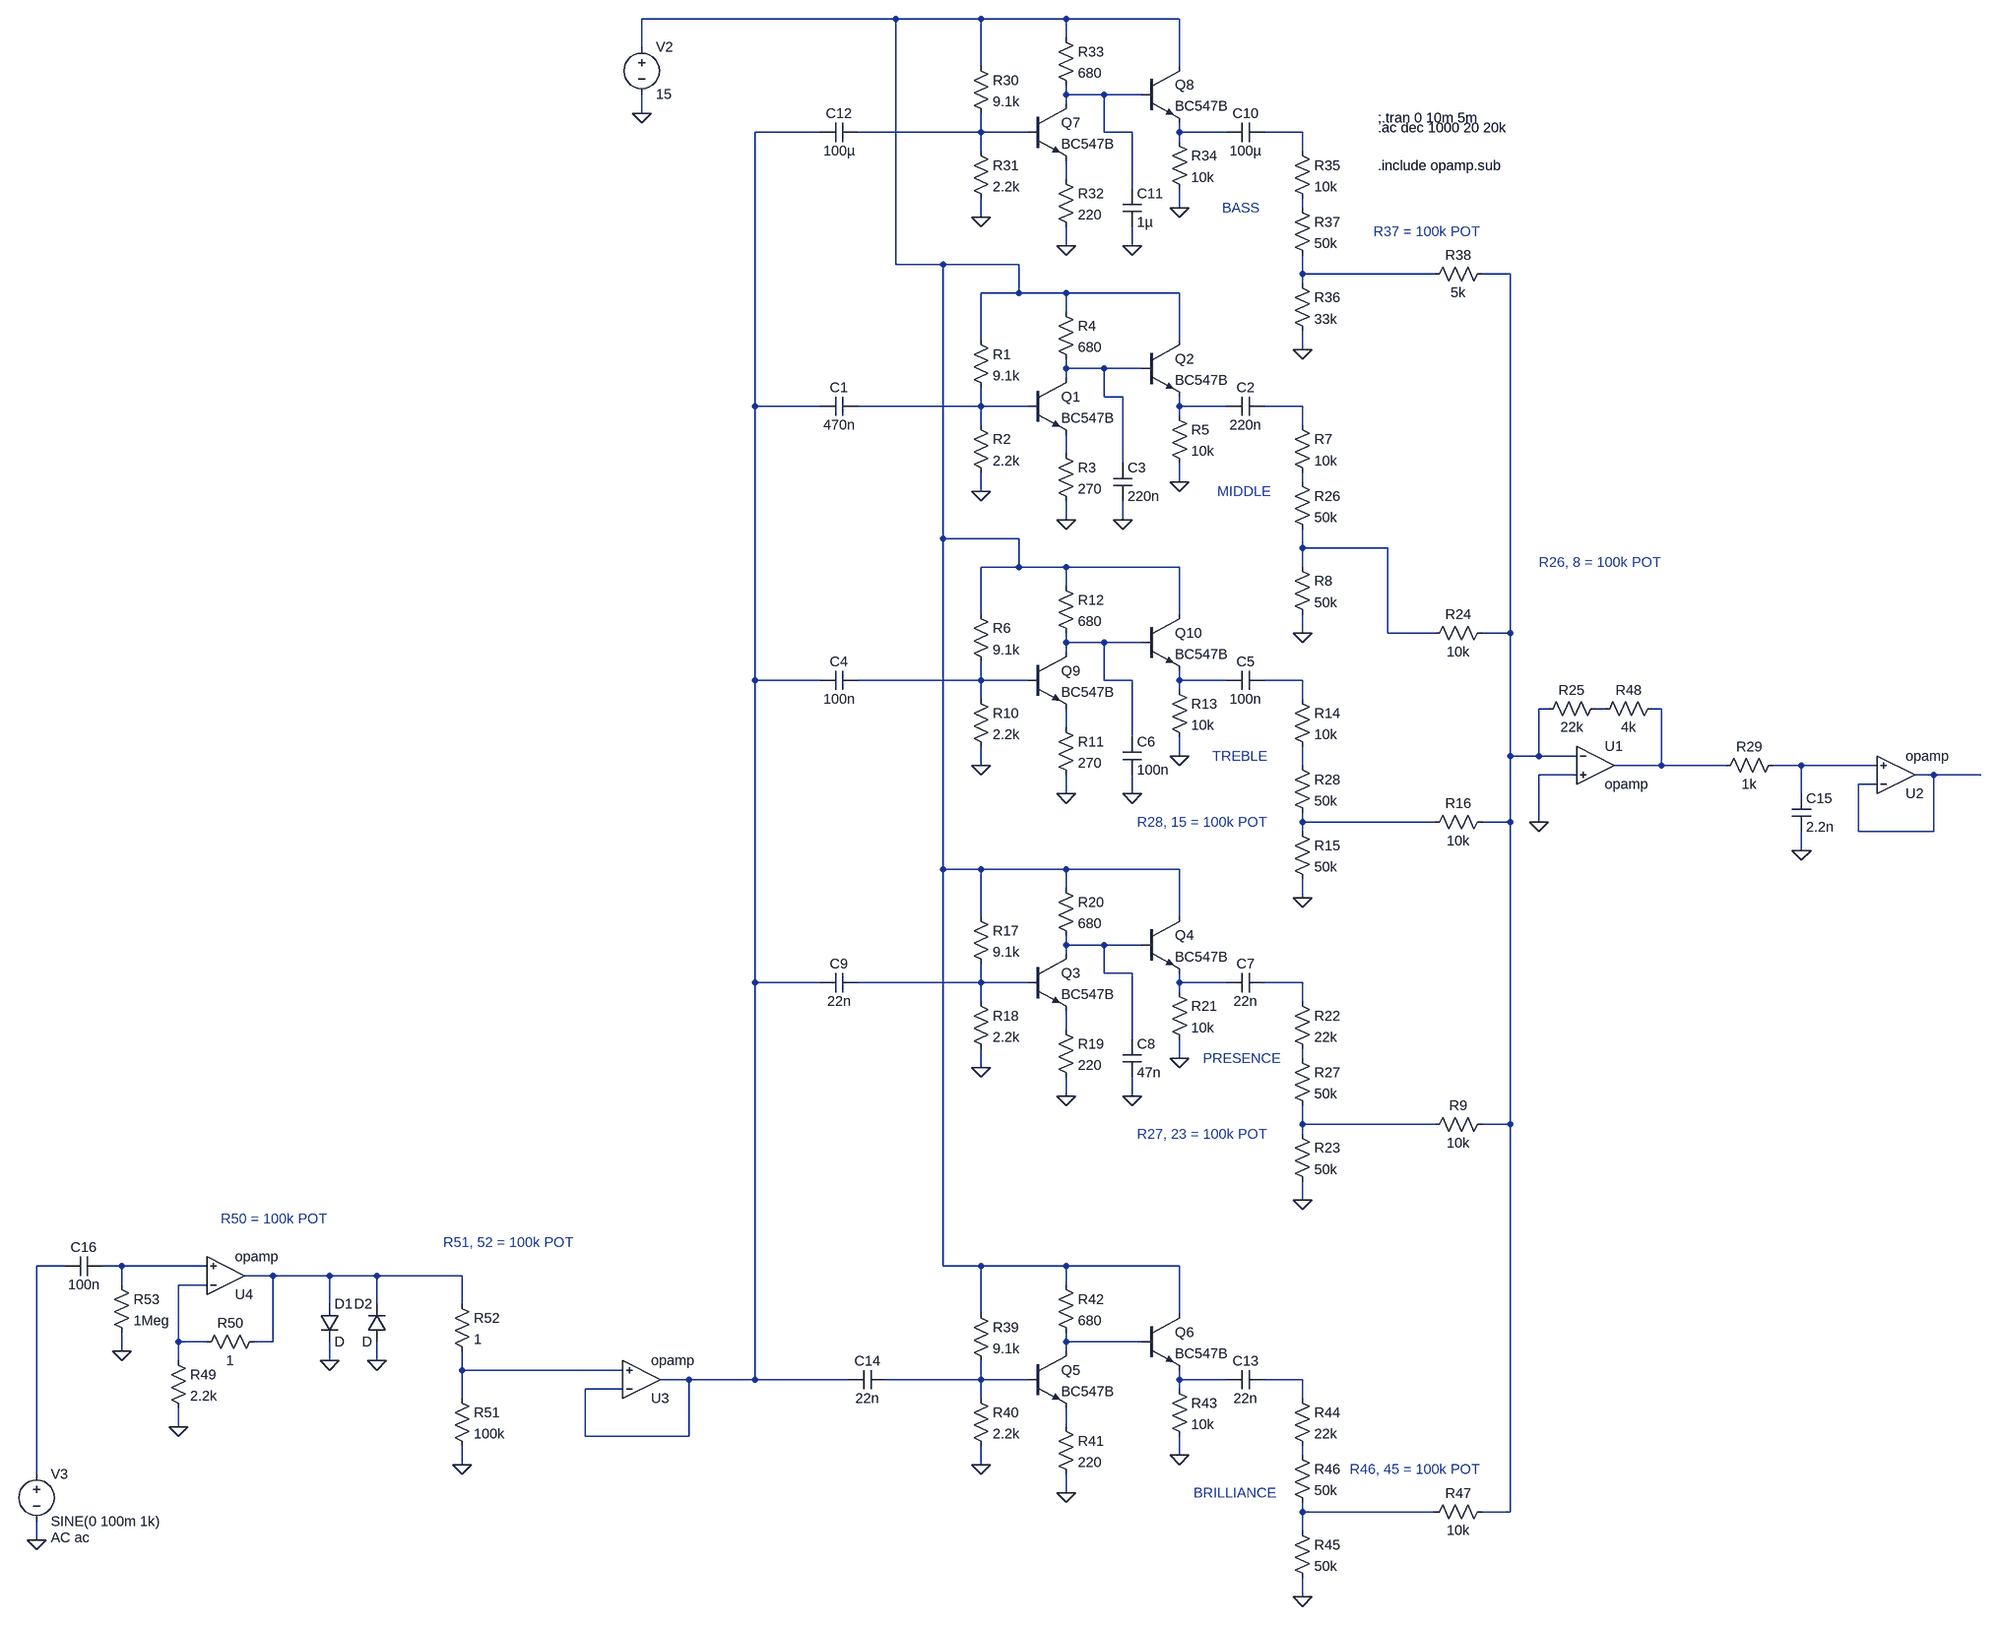
[diagram p0: schematic active-five-band-eq.asc]
active-five-band-eq.asc, the LTspice schematic file:
Version 4
SHEET 1 2264 2196
WIRE -48 -576 -480 -576
WIRE 96 -576 -48 -576
WIRE 240 -576 96 -576
WIRE 432 -576 240 -576
WIRE 240 -544 240 -576
WIRE -480 -528 -480 -576
WIRE 96 -496 96 -576
WIRE 432 -496 432 -576
WIRE 240 -448 240 -464
WIRE 304 -448 240 -448
WIRE 368 -448 304 -448
WIRE 240 -432 240 -448
WIRE -480 -416 -480 -448
WIRE -176 -384 -288 -384
WIRE 96 -384 96 -416
WIRE 96 -384 -112 -384
WIRE 176 -384 96 -384
WIRE 304 -384 304 -448
WIRE 352 -384 304 -384
WIRE 432 -384 432 -400
WIRE 512 -384 432 -384
WIRE 640 -384 576 -384
WIRE 432 -368 432 -384
WIRE 96 -352 96 -384
WIRE 640 -352 640 -384
WIRE 240 -304 240 -336
WIRE 352 -288 352 -384
WIRE 432 -256 432 -288
WIRE 640 -256 640 -272
WIRE 96 -240 96 -272
WIRE 240 -192 240 -224
WIRE 352 -192 352 -224
WIRE -48 -160 -48 -576
WIRE 32 -160 -48 -160
WIRE 160 -160 32 -160
WIRE 640 -144 640 -176
WIRE 864 -144 640 -144
WIRE 992 -144 944 -144
WIRE 640 -128 640 -144
WIRE 160 -112 160 -160
WIRE 160 -112 96 -112
WIRE 240 -112 160 -112
WIRE 432 -112 240 -112
WIRE 240 -80 240 -112
WIRE 96 -32 96 -112
WIRE 432 -32 432 -112
WIRE 640 -16 640 -48
WIRE 240 16 240 0
WIRE 304 16 240 16
WIRE 368 16 304 16
WIRE 240 32 240 16
WIRE 304 64 304 16
WIRE 336 64 304 64
WIRE -288 80 -288 -384
WIRE -176 80 -288 80
WIRE 96 80 96 48
WIRE 96 80 -112 80
WIRE 176 80 96 80
WIRE 432 80 432 64
WIRE 512 80 432 80
WIRE 640 80 576 80
WIRE 432 96 432 80
WIRE 96 112 96 80
WIRE 640 112 640 80
WIRE 240 160 240 128
WIRE 336 176 336 64
WIRE 432 208 432 176
WIRE 640 208 640 192
WIRE 96 224 96 192
WIRE 240 272 240 240
WIRE 336 272 336 240
WIRE 32 304 32 -160
WIRE 160 304 32 304
WIRE 640 320 640 288
WIRE 784 320 640 320
WIRE 160 352 160 304
WIRE 160 352 96 352
WIRE 240 352 160 352
WIRE 432 352 240 352
WIRE 640 352 640 320
WIRE 240 384 240 352
WIRE 96 432 96 352
WIRE 432 432 432 352
WIRE 640 464 640 432
WIRE 784 464 784 320
WIRE 864 464 784 464
WIRE 992 464 992 -144
WIRE 992 464 944 464
WIRE 240 480 240 464
WIRE 304 480 240 480
WIRE 368 480 304 480
WIRE 240 496 240 480
WIRE -288 544 -288 80
WIRE -176 544 -288 544
WIRE 96 544 96 512
WIRE 96 544 -112 544
WIRE 176 544 96 544
WIRE 304 544 304 480
WIRE 352 544 304 544
WIRE 432 544 432 528
WIRE 512 544 432 544
WIRE 640 544 576 544
WIRE 432 560 432 544
WIRE 96 576 96 544
WIRE 640 576 640 544
WIRE 1056 592 1040 592
WIRE 1152 592 1136 592
WIRE 1248 592 1232 592
WIRE 240 624 240 592
WIRE 352 640 352 544
WIRE 432 672 432 640
WIRE 992 672 992 464
WIRE 1040 672 1040 592
WIRE 1040 672 992 672
WIRE 1104 672 1040 672
WIRE 96 688 96 656
WIRE 640 688 640 656
WIRE 1248 688 1248 592
WIRE 1248 688 1168 688
WIRE 1360 688 1248 688
WIRE 1488 688 1440 688
WIRE 1616 688 1488 688
WIRE 1104 704 1040 704
WIRE 1712 704 1680 704
WIRE 1792 704 1712 704
WIRE 1616 720 1584 720
WIRE 240 736 240 704
WIRE 352 736 352 704
WIRE 1488 736 1488 688
WIRE 640 784 640 768
WIRE 864 784 640 784
WIRE 992 784 992 672
WIRE 992 784 944 784
WIRE 1040 784 1040 704
WIRE 640 800 640 784
WIRE 1584 800 1584 720
WIRE 1712 800 1712 704
WIRE 1712 800 1584 800
WIRE 1488 832 1488 800
WIRE 32 864 32 304
WIRE 96 864 32 864
WIRE 240 864 96 864
WIRE 432 864 240 864
WIRE 240 896 240 864
WIRE 640 912 640 880
WIRE 96 944 96 864
WIRE 432 944 432 864
WIRE 240 992 240 976
WIRE 304 992 240 992
WIRE 368 992 304 992
WIRE 240 1008 240 992
WIRE 304 1040 304 992
WIRE 352 1040 304 1040
WIRE -288 1056 -288 544
WIRE -176 1056 -288 1056
WIRE 96 1056 96 1024
WIRE 96 1056 -112 1056
WIRE 176 1056 96 1056
WIRE 432 1056 432 1040
WIRE 512 1056 432 1056
WIRE 640 1056 576 1056
WIRE 432 1072 432 1056
WIRE 96 1088 96 1056
WIRE 640 1088 640 1056
WIRE 240 1136 240 1104
WIRE 352 1152 352 1040
WIRE 432 1184 432 1152
WIRE 640 1184 640 1168
WIRE 96 1200 96 1168
WIRE 240 1248 240 1216
WIRE 352 1248 352 1216
WIRE 640 1296 640 1264
WIRE 864 1296 640 1296
WIRE 992 1296 992 784
WIRE 992 1296 944 1296
WIRE 640 1312 640 1296
WIRE 640 1424 640 1392
WIRE -1456 1536 -1504 1536
WIRE -1360 1536 -1392 1536
WIRE -1216 1536 -1360 1536
WIRE 32 1536 32 864
WIRE 96 1536 32 1536
WIRE 240 1536 96 1536
WIRE 432 1536 240 1536
WIRE -1104 1552 -1152 1552
WIRE -1008 1552 -1104 1552
WIRE -928 1552 -1008 1552
WIRE -784 1552 -928 1552
WIRE -1360 1568 -1360 1536
WIRE -1216 1568 -1264 1568
WIRE 240 1568 240 1536
WIRE -1008 1600 -1008 1552
WIRE -928 1600 -928 1552
WIRE -784 1600 -784 1552
WIRE 96 1616 96 1536
WIRE 432 1616 432 1536
WIRE -1264 1664 -1264 1568
WIRE -1216 1664 -1264 1664
WIRE -1104 1664 -1104 1552
WIRE -1104 1664 -1136 1664
WIRE 240 1664 240 1648
WIRE 368 1664 240 1664
WIRE -1360 1680 -1360 1648
WIRE 240 1680 240 1664
WIRE -1264 1696 -1264 1664
WIRE -1008 1696 -1008 1664
WIRE -928 1696 -928 1664
WIRE -784 1712 -784 1680
WIRE -512 1712 -784 1712
WIRE -400 1728 -448 1728
WIRE -288 1728 -288 1056
WIRE -288 1728 -400 1728
WIRE -128 1728 -288 1728
WIRE 96 1728 96 1696
WIRE 96 1728 -64 1728
WIRE 176 1728 96 1728
WIRE 432 1728 432 1712
WIRE 512 1728 432 1728
WIRE 640 1728 576 1728
WIRE -512 1744 -576 1744
WIRE 432 1744 432 1728
WIRE -784 1760 -784 1712
WIRE 96 1760 96 1728
WIRE 640 1760 640 1728
WIRE -1264 1808 -1264 1776
WIRE 240 1808 240 1776
WIRE -576 1824 -576 1744
WIRE -400 1824 -400 1728
WIRE -400 1824 -576 1824
WIRE 432 1856 432 1824
WIRE 640 1856 640 1840
WIRE -784 1872 -784 1840
WIRE 96 1872 96 1840
WIRE -1504 1888 -1504 1536
WIRE 240 1920 240 1888
WIRE 640 1952 640 1936
WIRE 864 1952 640 1952
WIRE 992 1952 992 1296
WIRE 992 1952 944 1952
WIRE 640 1984 640 1952
WIRE -1504 2000 -1504 1968
WIRE 640 2096 640 2064
FLAG 96 224 0
FLAG 240 272 0
FLAG -480 -416 0
FLAG 432 208 0
FLAG 640 464 0
FLAG 336 272 0
FLAG -1504 2000 0
FLAG 96 688 0
FLAG 240 736 0
FLAG 432 672 0
FLAG 640 912 0
FLAG 352 736 0
FLAG 96 1200 0
FLAG 240 1248 0
FLAG 432 1184 0
FLAG 640 1424 0
FLAG 1040 784 0
FLAG 96 -240 0
FLAG 240 -192 0
FLAG 432 -256 0
FLAG 640 -16 0
FLAG 352 -192 0
FLAG 352 1248 0
FLAG 96 1872 0
FLAG 240 1920 0
FLAG 432 1856 0
FLAG 640 2096 0
FLAG 1488 832 0
FLAG -1264 1808 0
FLAG -784 1872 0
FLAG -1008 1696 0
FLAG -928 1696 0
FLAG -1360 1680 0
SYMBOL cap -112 64 R90
WINDOW 0 0 32 VBottom 2
WINDOW 3 32 32 VTop 2
SYMATTR InstName C1
SYMATTR Value 470n
SYMBOL res 80 -48 R0
SYMATTR InstName R1
SYMATTR Value 9.1k
SYMBOL res 80 96 R0
SYMATTR InstName R2
SYMATTR Value 2.2k
SYMBOL res 224 144 R0
SYMATTR InstName R3
SYMATTR Value 270
SYMBOL res 224 -96 R0
SYMATTR InstName R4
SYMATTR Value 680
SYMBOL voltage -480 -544 R0
WINDOW 123 0 0 Left 0
WINDOW 39 0 0 Left 0
SYMATTR InstName V2
SYMATTR Value 15
SYMBOL res 416 80 R0
SYMATTR InstName R5
SYMATTR Value 10k
SYMBOL cap 576 64 R90
WINDOW 0 0 32 VBottom 2
WINDOW 3 32 32 VTop 2
SYMATTR InstName C2
SYMATTR Value 220n
SYMBOL res 624 96 R0
SYMATTR InstName R7
SYMATTR Value 10k
SYMBOL res 624 336 R0
SYMATTR InstName R8
SYMATTR Value 50k
SYMBOL cap 320 176 R0
SYMATTR InstName C3
SYMATTR Value 220n
SYMBOL voltage -1504 1872 R0
WINDOW 123 24 124 Left 2
WINDOW 39 0 0 Left 0
SYMATTR Value2 AC ac
SYMATTR InstName V3
SYMATTR Value SINE(0 100m 1k)
SYMBOL cap -112 528 R90
WINDOW 0 0 32 VBottom 2
WINDOW 3 32 32 VTop 2
SYMATTR InstName C4
SYMATTR Value 100n
SYMBOL res 80 416 R0
SYMATTR InstName R6
SYMATTR Value 9.1k
SYMBOL res 80 560 R0
SYMATTR InstName R10
SYMATTR Value 2.2k
SYMBOL res 224 608 R0
SYMATTR InstName R11
SYMATTR Value 270
SYMBOL res 224 368 R0
SYMATTR InstName R12
SYMATTR Value 680
SYMBOL res 416 544 R0
SYMATTR InstName R13
SYMATTR Value 10k
SYMBOL cap 576 528 R90
WINDOW 0 0 32 VBottom 2
WINDOW 3 32 32 VTop 2
SYMATTR InstName C5
SYMATTR Value 100n
SYMBOL res 624 560 R0
SYMATTR InstName R14
SYMATTR Value 10k
SYMBOL res 624 784 R0
SYMATTR InstName R15
SYMATTR Value 50k
SYMBOL cap 336 640 R0
SYMATTR InstName C6
SYMATTR Value 100n
SYMBOL res 80 928 R0
SYMATTR InstName R17
SYMATTR Value 9.1k
SYMBOL res 80 1072 R0
SYMATTR InstName R18
SYMATTR Value 2.2k
SYMBOL res 224 1120 R0
SYMATTR InstName R19
SYMATTR Value 220
SYMBOL res 224 880 R0
SYMATTR InstName R20
SYMATTR Value 680
SYMBOL res 416 1056 R0
SYMATTR InstName R21
SYMATTR Value 10k
SYMBOL cap 576 1040 R90
WINDOW 0 0 32 VBottom 2
WINDOW 3 32 32 VTop 2
SYMATTR InstName C7
SYMATTR Value 22n
SYMBOL res 624 1072 R0
SYMATTR InstName R22
SYMATTR Value 22k
SYMBOL res 624 1296 R0
SYMATTR InstName R23
SYMATTR Value 50k
SYMBOL cap -112 1040 R90
WINDOW 0 0 32 VBottom 2
WINDOW 3 32 32 VTop 2
SYMATTR InstName C9
SYMATTR Value 22n
SYMBOL OpAmps\\opamp 1136 624 R0
SYMATTR InstName U1
SYMBOL res 960 768 R90
WINDOW 0 0 56 VBottom 2
WINDOW 3 32 56 VTop 2
SYMATTR InstName R16
SYMATTR Value 10k
SYMBOL res 960 448 R90
WINDOW 0 0 56 VBottom 2
WINDOW 3 32 56 VTop 2
SYMATTR InstName R24
SYMATTR Value 10k
SYMBOL res 624 192 R0
SYMATTR InstName R26
SYMATTR Value 50k
SYMBOL res 624 1168 R0
SYMATTR InstName R27
SYMATTR Value 50k
SYMBOL res 960 1280 R90
WINDOW 0 0 56 VBottom 2
WINDOW 3 32 56 VTop 2
SYMATTR InstName R9
SYMATTR Value 10k
SYMBOL res 624 672 R0
SYMATTR InstName R28
SYMATTR Value 50k
SYMATTR SpiceLine tol=100k
SYMBOL res 80 -512 R0
SYMATTR InstName R30
SYMATTR Value 9.1k
SYMBOL res 80 -368 R0
SYMATTR InstName R31
SYMATTR Value 2.2k
SYMBOL npn 176 -432 R0
SYMATTR InstName Q7
SYMATTR Value BC547B
SYMBOL res 224 -320 R0
SYMATTR InstName R32
SYMATTR Value 220
SYMBOL res 224 -560 R0
SYMATTR InstName R33
SYMATTR Value 680
SYMBOL npn 368 -496 R0
SYMATTR InstName Q8
SYMATTR Value BC547B
SYMBOL res 416 -384 R0
SYMATTR InstName R34
SYMATTR Value 10k
SYMBOL cap 576 -400 R90
WINDOW 0 0 32 VBottom 2
WINDOW 3 32 32 VTop 2
SYMATTR InstName C10
SYMATTR Value 100µ
SYMATTR SpiceLine Rser=8
SYMBOL res 624 -368 R0
SYMATTR InstName R35
SYMATTR Value 10k
SYMBOL res 624 -144 R0
SYMATTR InstName R36
SYMATTR Value 33k
SYMBOL cap 336 -288 R0
SYMATTR InstName C11
SYMATTR Value 1µ
SYMBOL cap -112 -400 R90
WINDOW 0 0 32 VBottom 2
WINDOW 3 32 32 VTop 2
SYMATTR InstName C12
SYMATTR Value 100µ
SYMATTR SpiceLine Rser=8
SYMBOL res 624 -272 R0
SYMATTR InstName R37
SYMATTR Value 50k
SYMBOL res 960 -160 R90
WINDOW 0 0 56 VBottom 2
WINDOW 3 32 56 VTop 2
SYMATTR InstName R38
SYMATTR Value 5k
SYMBOL cap 336 1152 R0
SYMATTR InstName C8
SYMATTR Value 47n
SYMBOL res 80 1600 R0
SYMATTR InstName R39
SYMATTR Value 9.1k
SYMBOL res 80 1744 R0
SYMATTR InstName R40
SYMATTR Value 2.2k
SYMBOL res 224 1792 R0
SYMATTR InstName R41
SYMATTR Value 220
SYMBOL res 224 1552 R0
SYMATTR InstName R42
SYMATTR Value 680
SYMBOL res 416 1728 R0
SYMATTR InstName R43
SYMATTR Value 10k
SYMBOL cap 576 1712 R90
WINDOW 0 0 32 VBottom 2
WINDOW 3 32 32 VTop 2
SYMATTR InstName C13
SYMATTR Value 22n
SYMBOL res 624 1744 R0
SYMATTR InstName R44
SYMATTR Value 22k
SYMBOL res 624 1968 R0
SYMATTR InstName R45
SYMATTR Value 50k
SYMBOL res 624 1840 R0
SYMATTR InstName R46
SYMATTR Value 50k
SYMBOL res 960 1936 R90
WINDOW 0 0 56 VBottom 2
WINDOW 3 32 56 VTop 2
SYMATTR InstName R47
SYMATTR Value 10k
SYMBOL cap -64 1712 R90
WINDOW 0 0 32 VBottom 2
WINDOW 3 32 32 VTop 2
SYMATTR InstName C14
SYMATTR Value 22n
SYMBOL res 1152 576 R90
WINDOW 0 0 56 VBottom 2
WINDOW 3 32 56 VTop 2
SYMATTR InstName R25
SYMATTR Value 22k
SYMBOL res 1456 672 R90
WINDOW 0 0 56 VBottom 2
WINDOW 3 32 56 VTop 2
SYMATTR InstName R29
SYMATTR Value 1k
SYMBOL OpAmps\\opamp 1648 768 M180
SYMATTR InstName U2
SYMBOL cap 1472 736 R0
SYMATTR InstName C15
SYMATTR Value 2.2n
SYMBOL res 1248 576 R90
WINDOW 0 0 56 VBottom 2
WINDOW 3 32 56 VTop 2
SYMATTR InstName R48
SYMATTR Value 4k
SYMBOL npn 176 32 R0
SYMATTR InstName Q1
SYMATTR Value BC547B
SYMBOL npn 368 -32 R0
SYMATTR InstName Q2
SYMATTR Value BC547B
SYMBOL npn 176 1008 R0
SYMATTR InstName Q3
SYMATTR Value BC547B
SYMBOL npn 368 944 R0
SYMATTR InstName Q4
SYMATTR Value BC547B
SYMBOL npn 176 1680 R0
SYMATTR InstName Q5
SYMATTR Value BC547B
SYMBOL npn 368 1616 R0
SYMATTR InstName Q6
SYMATTR Value BC547B
SYMBOL npn 176 496 R0
SYMATTR InstName Q9
SYMATTR Value BC547B
SYMBOL npn 368 432 R0
SYMATTR InstName Q10
SYMATTR Value BC547B
SYMBOL OpAmps\\opamp -480 1792 M180
SYMATTR InstName U3
SYMBOL OpAmps\\opamp -1184 1616 M180
SYMATTR InstName U4
SYMBOL cap -1392 1520 R90
WINDOW 0 0 32 VBottom 2
WINDOW 3 32 32 VTop 2
SYMATTR InstName C16
SYMATTR Value 100n
SYMBOL res -1280 1680 R0
SYMATTR InstName R49
SYMATTR Value 2.2k
SYMBOL res -1120 1648 R90
WINDOW 0 0 56 VBottom 2
WINDOW 3 32 56 VTop 2
SYMATTR InstName R50
SYMATTR Value 1
SYMBOL res -800 1744 R0
SYMATTR InstName R51
SYMATTR Value 100k
SYMBOL res -800 1584 R0
SYMATTR InstName R52
SYMATTR Value 1
SYMBOL diode -1024 1600 R0
SYMATTR InstName D1
SYMBOL diode -912 1664 R180
WINDOW 0 24 64 Left 2
WINDOW 3 24 0 Left 2
SYMATTR InstName D2
SYMBOL res -1376 1552 R0
SYMATTR InstName R53
SYMATTR Value 1Meg
TEXT 768 -408 Left 2 !;.tran 0 10m 5m
TEXT 768 -392 Left 2 !.ac dec 1000 20 20k
TEXT 496 224 Left 2 ;MIDDLE
TEXT 488 672 Left 2 ;TREBLE
TEXT 472 1184 Left 2 ;PRESENCE
TEXT 768 -328 Left 2 !.include opamp.sub
TEXT 504 -256 Left 2 ;BASS
TEXT 456 1920 Left 2 ;BRILLIANCE
TEXT 720 1880 Left 2 ;R46, 45 = 100k POT
TEXT 360 1312 Left 2 ;R27, 23 = 100k POT
TEXT 360 784 Left 2 ;R28, 15 = 100k POT
TEXT 1040 344 Left 2 ;R26, 8 = 100k POT
TEXT 760 -216 Left 2 ;R37 = 100k POT
TEXT -1192 1456 Left 2 ;R50 = 100k POT
TEXT -816 1496 Left 2 ;R51, 52 = 100k POT

The netlist it stands for:
* active-five-band-eq.asc
C1 N012 N003 470n
R1 N001 N012 9.1k
R2 N012 0 2.2k
R3 N015 0 270
R4 N001 N011 680
V2 N001 0 15
R5 N013 0 10k
C2 N014 N013 220n
R7 N014 N016 10k
R8 N017 0 50k
C3 N011 0 220n
V3 N036 0 SINE(0 100m 1k) AC ac
C4 N019 N003 100n
R6 N001 N019 9.1k
R10 N019 0 2.2k
R11 N024 0 270
R12 N001 N018 680
R13 N020 0 10k
C5 N021 N020 100n
R14 N021 N025 10k
R15 N028 0 50k
C6 N018 0 100n
R17 N001 N030 9.1k
R18 N030 0 2.2k
R19 N033 0 220
R20 N001 N029 680
R21 N031 0 10k
C7 N032 N031 22n
R22 N032 N034 22k
R23 N035 0 50k
C9 N030 N003 22n
XU1 N010 0 N023 opamp Aol=100K GBW=10Meg  ; pins invin noninvin out
R16 N010 N028 10k
R24 N010 N017 10k
R26 N016 N017 50k
R27 N034 N035 50k
R9 N010 N035 10k
R28 N025 N028 50k tol=100k
R30 N001 N004 9.1k
R31 N004 0 2.2k
Q7 N002 N004 N007 0 BC547B
R32 N007 0 220
R33 N001 N002 680
Q8 N001 N002 N005 0 BC547B
R34 N005 0 10k
C10 N006 N005 100µ Rser=8
R35 N006 N008 10k
R36 N009 0 33k
C11 N002 0 1µ
C12 N004 N003 100µ Rser=8
R37 N008 N009 50k
R38 N010 N009 5k
C8 N029 0 47n
R39 N001 N042 9.1k
R40 N042 0 2.2k
R41 N045 0 220
R42 N001 N040 680
R43 N043 0 10k
C13 N044 N043 22n
R44 N044 N046 22k
R45 N047 0 50k
R46 N046 N047 50k
R47 N010 N047 10k
C14 N042 N003 22n
R25 N022 N010 22k
R29 N026 N023 1k
XU2 N027 N026 N027 opamp Aol=100K GBW=10Meg  ; pins invin noninvin out
C15 N026 0 2.2n
R48 N023 N022 4k
Q1 N011 N012 N015 0 BC547B
Q2 N001 N011 N013 0 BC547B
Q3 N029 N030 N033 0 BC547B
Q4 N001 N029 N031 0 BC547B
Q5 N040 N042 N045 0 BC547B
Q6 N001 N040 N043 0 BC547B
Q9 N018 N019 N024 0 BC547B
Q10 N001 N018 N020 0 BC547B
XU3 N003 N041 N003 opamp Aol=100K GBW=10Meg  ; pins invin noninvin out
XU4 N039 N037 N038 opamp Aol=100K GBW=10Meg  ; pins invin noninvin out
C16 N037 N036 100n
R49 N039 0 2.2k
R50 N038 N039 1
R51 N041 0 100k
R52 N038 N041 1
D1 N038 0 D
D2 0 N038 D
R53 N037 0 1Meg
.model D D
.lib standard.dio
.model NPN NPN
.model PNP PNP
.lib standard.bjt
;.tran 0 10m 5m
.ac dec 1000 20 20k
* MIDDLE
* TREBLE
* PRESENCE
.include opamp.sub
* BASS
* BRILLIANCE
* R46, 45 = 100k POT
* R27, 23 = 100k POT
* R28, 15 = 100k POT
* R26, 8 = 100k POT
* R37 = 100k POT
* R50 = 100k POT
* R51, 52 = 100k POT
.backanno
.end